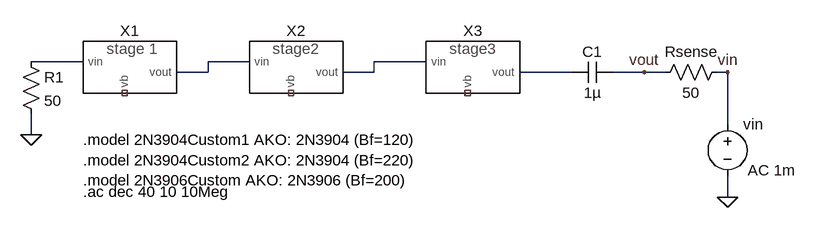
[diagram p0: schematic integration_ac_rout.asc]
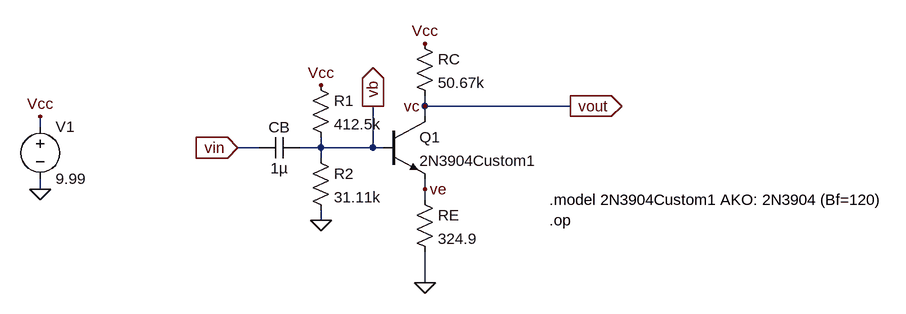
[diagram p1: sub-circuit stage1.asc]
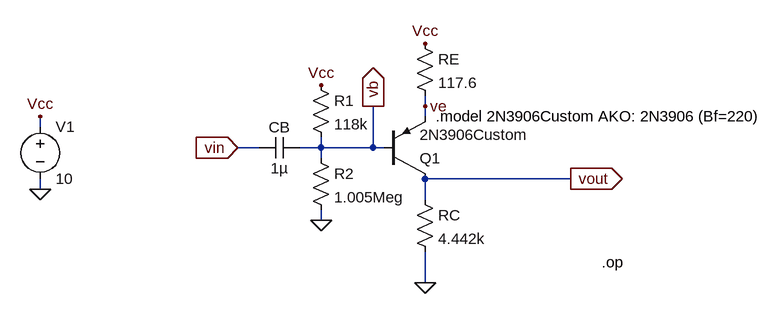
[diagram p2: sub-circuit stage2.asc]
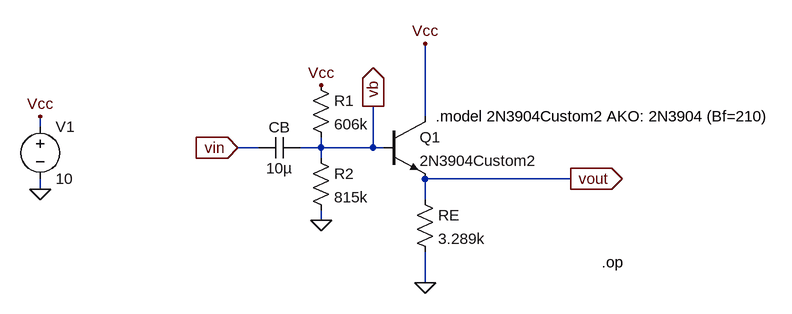
[diagram p3: sub-circuit stage3.asc]
integration_ac_rout.asc, the LTspice schematic file:
Version 4
SHEET 1 1516 680
WIRE 416 112 336 112
WIRE 672 112 608 112
WIRE 944 112 864 112
WIRE 608 128 608 112
WIRE 608 128 560 128
WIRE 864 128 864 112
WIRE 864 128 816 128
WIRE 1168 128 1088 128
WIRE 1280 128 1232 128
WIRE 1312 128 1280 128
WIRE 1408 128 1392 128
WIRE 1408 208 1408 128
WIRE 336 224 336 192
WIRE 1408 320 1408 288
FLAG 1408 320 0
FLAG 1280 128 vout
FLAG 1408 128 vin
FLAG 336 224 0
SYMBOL Voltage 1408 192 R0
WINDOW 123 31 87 Left 2
SYMATTR Value2 AC 1m
SYMATTR InstName vin
SYMATTR Value ""
SYMBOL stage1 480 112 R0
SYMATTR InstName X1
SYMBOL stage2 736 112 R0
SYMATTR InstName X2
SYMBOL stage3 1008 128 R0
SYMATTR InstName X3
SYMBOL Res 320 96 R0
SYMATTR InstName R1
SYMATTR Value 50
SYMBOL Res 1408 112 R90
WINDOW 0 0 56 VBottom 2
WINDOW 3 32 56 VTop 2
SYMATTR InstName Rsense
SYMATTR Value 50
SYMBOL Cap 1232 112 R90
WINDOW 0 0 32 VBottom 2
WINDOW 3 32 32 VTop 2
SYMATTR InstName C1
SYMATTR Value 1µ
TEXT 416 312 Left 2 !.ac dec 40 10 10Meg
TEXT 416 232 Left 2 !.model 2N3904Custom1 AKO: 2N3904 (Bf=120)\n.model 2N3904Custom2 AKO: 2N3904 (Bf=220)\n.model 2N3906Custom AKO: 2N3906 (Bf=200)

stage1.asc, the sub-circuit schematic file:
Version 4
SHEET 1 1252 680
WIRE 528 160 528 144
WIRE 752 160 528 160
WIRE 528 176 528 160
WIRE -64 192 -64 176
WIRE 272 224 240 224
WIRE 368 224 368 208
WIRE 368 224 336 224
WIRE 448 224 448 160
WIRE 448 224 368 224
WIRE 464 224 448 224
WIRE 368 240 368 224
WIRE -64 288 -64 272
WIRE 528 288 528 272
WIRE 528 304 528 288
WIRE 368 336 368 320
WIRE 528 432 528 384
FLAG 368 336 0
FLAG 240 224 vin
IOPIN 240 224 In
FLAG 448 160 vb
IOPIN 448 160 Out
FLAG 528 160 vc
FLAG 368 128 Vcc
FLAG 528 64 Vcc
FLAG 752 160 vout
IOPIN 752 160 Out
FLAG 528 432 0
FLAG -64 288 0
FLAG -64 176 Vcc
FLAG 528 288 ve
SYMBOL Res 352 112 R0
SYMATTR InstName R1
SYMATTR Value 412.5k
SYMBOL Res 352 224 R0
SYMATTR InstName R2
SYMATTR Value 31.11k
SYMBOL Cap 336 208 R90
WINDOW 0 0 32 VBottom 2
WINDOW 3 32 32 VTop 2
SYMATTR InstName CB
SYMATTR Value 1µ
SYMBOL Res 512 48 R0
SYMATTR InstName RC
SYMATTR Value 50.67k
SYMBOL Res 512 288 R0
SYMATTR InstName RE
SYMATTR Value 324.9
SYMBOL Voltage -64 176 R0
SYMATTR InstName V1
SYMATTR Value 9.99
SYMBOL npn 464 176 R0
SYMATTR InstName Q1
SYMATTR Value 2N3904Custom1
TEXT 720 304 Left 2 !.model 2N3904Custom1 AKO: 2N3904 (Bf=120)
TEXT 720 336 Left 2 !.op

stage2.asc, the sub-circuit schematic file:
Version 4
SHEET 1 1220 680
WIRE 528 160 528 144
WIRE 528 176 528 160
WIRE -64 192 -64 176
WIRE 272 224 240 224
WIRE 368 224 368 208
WIRE 368 224 336 224
WIRE 448 224 448 160
WIRE 448 224 368 224
WIRE 464 224 448 224
WIRE 368 240 368 224
WIRE 752 272 528 272
WIRE -64 288 -64 272
WIRE 528 304 528 272
WIRE 368 336 368 320
WIRE 528 432 528 384
FLAG 368 336 0
FLAG 240 224 vin
IOPIN 240 224 In
FLAG 448 160 vb
IOPIN 448 160 Out
FLAG 528 160 ve
FLAG 368 128 Vcc
FLAG 528 64 Vcc
FLAG 752 272 vout
IOPIN 752 272 Out
FLAG 528 432 0
FLAG -64 288 0
FLAG -64 176 Vcc
SYMBOL Res 352 112 R0
SYMATTR InstName R1
SYMATTR Value 118k
SYMBOL Res 352 224 R0
SYMATTR InstName R2
SYMATTR Value 1.005Meg
SYMBOL Cap 336 208 R90
WINDOW 0 0 32 VBottom 2
WINDOW 3 32 32 VTop 2
SYMATTR InstName CB
SYMATTR Value 1µ
SYMBOL Res 512 48 R0
SYMATTR InstName RE
SYMATTR Value 117.6
SYMBOL Res 512 288 R0
SYMATTR InstName RC
SYMATTR Value 4.442k
SYMBOL pnp 464 272 M180
SYMATTR InstName Q1
SYMATTR Value 2N3906Custom
SYMBOL Voltage -64 176 R0
SYMATTR InstName V1
SYMATTR Value 10
TEXT 544 176 Left 2 !.model 2N3906Custom AKO: 2N3906 (Bf=220)
TEXT 800 400 Left 2 !.op

stage3.asc, the sub-circuit schematic file:
Version 4
SHEET 1 1220 680
WIRE 528 176 528 64
WIRE -64 192 -64 176
WIRE 272 224 240 224
WIRE 368 224 368 208
WIRE 368 224 336 224
WIRE 448 224 448 160
WIRE 448 224 368 224
WIRE 464 224 448 224
WIRE 368 240 368 224
WIRE 752 272 528 272
WIRE -64 288 -64 272
WIRE 528 304 528 272
WIRE 368 336 368 320
WIRE 528 432 528 384
FLAG 368 336 0
FLAG 240 224 vin
IOPIN 240 224 In
FLAG 448 160 vb
IOPIN 448 160 Out
FLAG 368 128 Vcc
FLAG 528 64 Vcc
FLAG 752 272 vout
IOPIN 752 272 Out
FLAG 528 432 0
FLAG -64 288 0
FLAG -64 176 Vcc
SYMBOL Res 352 112 R0
SYMATTR InstName R1
SYMATTR Value 606k
SYMBOL Res 352 224 R0
SYMATTR InstName R2
SYMATTR Value 815k
SYMBOL Cap 336 208 R90
WINDOW 0 0 32 VBottom 2
WINDOW 3 32 32 VTop 2
SYMATTR InstName CB
SYMATTR Value 10µ
SYMBOL Res 512 288 R0
SYMATTR InstName RE
SYMATTR Value 3.289k
SYMBOL Voltage -64 176 R0
SYMATTR InstName V1
SYMATTR Value 10
SYMBOL npn 464 176 R0
SYMATTR InstName Q1
SYMATTR Value 2N3904Custom2
TEXT 544 176 Left 2 !.model 2N3904Custom2 AKO: 2N3904 (Bf=210)
TEXT 800 400 Left 2 !.op

The netlist it stands for:
* integration_ac_rout.asc
vin vin 0 AC 1m
XX1 N001 NC_01 N002 stage1
XX2 N002 NC_02 N003 stage2
XX3 N003 NC_03 N004 stage3
R1 N001 0 50
Rsense vin vout 50
C1 vout N004 1µ

* block symbol definitions
.subckt stage1 vin vb vout
R1 Vcc vb 412.5k
R2 vb 0 31.11k
CB vb vin 1µ
RC Vcc vout 50.67k
RE ve 0 324.9
V1 Vcc 0 9.99
Q1 vout vb ve 0 2N3904Custom1
.model 2N3904Custom1 AKO: 2N3904 (Bf=120)
.op
.ends stage1

.subckt stage2 vin vb vout
R1 Vcc vb 118k
R2 vb 0 1.005Meg
CB vb vin 1µ
RE Vcc ve 117.6
RC vout 0 4.442k
Q1 vout vb ve 0 2N3906Custom
V1 Vcc 0 10
.model 2N3906Custom AKO: 2N3906 (Bf=220)
.op
.ends stage2

.subckt stage3 vin vb vout
R1 Vcc vb 606k
R2 vb 0 815k
CB vb vin 10µ
RE vout 0 3.289k
V1 Vcc 0 10
Q1 Vcc vb vout 0 2N3904Custom2
.model 2N3904Custom2 AKO: 2N3904 (Bf=210)
.op
.ends stage3

.model NPN NPN
.model PNP PNP
.lib standard.bjt
.ac dec 40 10 10Meg
.model 2N3904Custom1 AKO: 2N3904 (Bf=120)
.model 2N3904Custom2 AKO: 2N3904 (Bf=220)
.model 2N3906Custom AKO: 2N3906 (Bf=200)
.backanno
.end